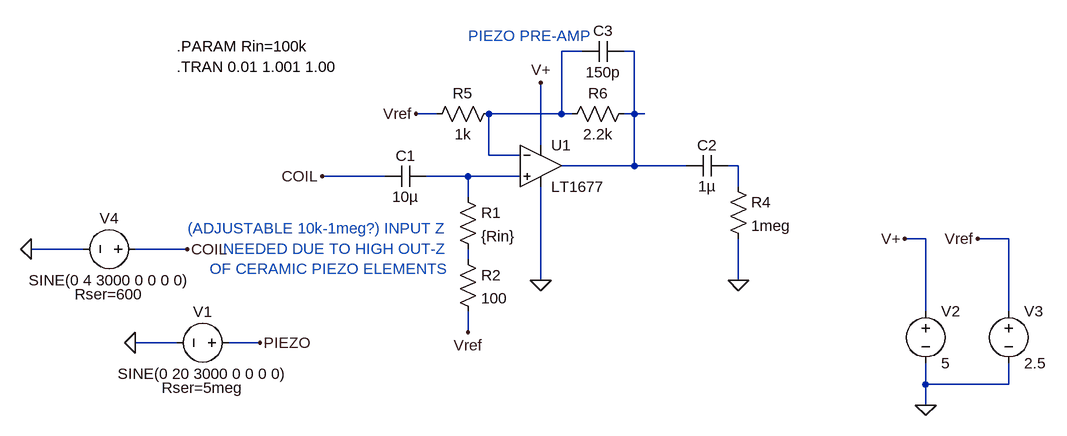
[diagram p0: schematic piezo_input_stage.asc]
piezo_input_stage.asc, the LTspice schematic file:
Version 4
SHEET 1 1100 680
WIRE 208 64 176 64
WIRE 288 64 272 64
WIRE -16 160 -48 160
WIRE 176 160 176 64
WIRE 176 160 64 160
WIRE 192 160 176 160
WIRE 288 160 288 64
WIRE 288 160 272 160
WIRE 304 160 288 160
WIRE 144 208 144 112
WIRE 64 224 64 160
WIRE 112 224 64 224
WIRE 288 240 288 160
WIRE 288 240 176 240
WIRE 368 240 288 240
WIRE 448 240 432 240
WIRE -96 256 -192 256
WIRE 32 256 -32 256
WIRE 112 256 32 256
WIRE 448 272 448 240
WIRE 32 288 32 256
WIRE 736 352 704 352
WIRE 864 352 816 352
WIRE -560 368 -640 368
WIRE -400 368 -480 368
WIRE 32 384 32 368
WIRE 144 416 144 272
WIRE 448 416 448 352
WIRE 736 464 736 352
WIRE 864 464 864 352
WIRE 32 496 32 464
WIRE -416 512 -480 512
WIRE -288 512 -336 512
WIRE 736 576 736 544
WIRE 864 576 864 544
WIRE 864 576 736 576
WIRE 736 608 736 576
FLAG 32 496 Vref
FLAG 144 416 0
FLAG 144 112 V+
FLAG -192 256 COIL
FLAG -480 512 0
FLAG -288 512 PIEZO
FLAG 704 352 V+
FLAG 816 352 Vref
FLAG 448 416 0
FLAG 736 608 0
FLAG -48 160 Vref
FLAG -640 368 0
FLAG -400 368 COIL
SYMBOL Opamps/LT1677 144 176 R0
SYMATTR InstName U1
SYMBOL cap -32 240 R90
WINDOW 0 0 32 VBottom 2
WINDOW 3 32 32 VTop 2
SYMATTR InstName C1
SYMATTR Value 10µ
SYMBOL res 16 272 R0
SYMATTR InstName R1
SYMATTR Value {Rin}
SYMBOL voltage -320 512 R90
WINDOW 0 -32 56 VBottom 2
WINDOW 3 32 56 VTop 2
WINDOW 39 54 56 VTop 2
SYMATTR InstName V1
SYMATTR Value SINE(0 20 3000 0 0 0 0)
SYMATTR SpiceLine Rser=5meg
SYMATTR Value2 AC 10
SYMBOL voltage 736 448 R0
SYMATTR InstName V2
SYMATTR Value 5
SYMBOL res 432 256 R0
SYMATTR InstName R4
SYMATTR Value 1meg
SYMBOL res 80 144 R90
WINDOW 0 0 56 VBottom 2
WINDOW 3 32 56 VTop 2
SYMATTR InstName R5
SYMATTR Value 1k
SYMBOL res 288 144 R90
WINDOW 0 0 56 VBottom 2
WINDOW 3 32 56 VTop 2
SYMATTR InstName R6
SYMATTR Value 2.2k
SYMBOL voltage 864 448 R0
SYMATTR InstName V3
SYMATTR Value 2.5
SYMBOL cap 432 224 R90
WINDOW 0 0 32 VBottom 2
WINDOW 3 32 32 VTop 2
SYMATTR InstName C2
SYMATTR Value 1µ
SYMBOL cap 272 48 R90
WINDOW 0 0 32 VBottom 2
WINDOW 3 32 32 VTop 2
SYMATTR InstName C3
SYMATTR Value 150p
SYMBOL voltage -464 368 R90
WINDOW 0 -32 56 VBottom 2
WINDOW 3 32 56 VTop 2
WINDOW 39 54 56 VTop 2
SYMATTR InstName V4
SYMATTR Value SINE(0 4 3000 0 0 0 0)
SYMATTR SpiceLine Rser=600
SYMATTR Value2 AC 10
SYMBOL res 16 368 R0
SYMATTR InstName R2
SYMATTR Value 100
TEXT 32 40 Left 2 ;PIEZO PRE-AMP
TEXT 0 336 Right 2 ;(ADJUSTABLE 10k-1meg?) INPUT Z\nNEEDED DUE TO HIGH OUT-Z\nOF CERAMIC PIEZO ELEMENTS
TEXT -416 56 Left 2 !.PARAM Rin=100k\n.TRAN 0.01 1.001 1.00

The netlist it stands for:
* piezo_input_stage.asc
XU1 N004 N001 V+ 0 N002 LT1677  ; pins In+ In- V+ V- OUT
C1 N004 COIL 10µ
R1 N004 N005 {Rin}
V1 PIEZO 0 SINE(0 20 3000 0 0 0 0) AC 10 Rser=5meg
V2 V+ 0 5
R4 N003 0 1meg
R5 N001 Vref 1k
R6 N002 N001 2.2k
V3 Vref 0 2.5
C2 N003 N002 1µ
C3 N002 N001 150p
V4 COIL 0 SINE(0 4 3000 0 0 0 0) AC 10 Rser=600
R2 N005 Vref 100
* PIEZO PRE-AMP
* (ADJUSTABLE 10k-1meg?) INPUT Z
* NEEDED DUE TO HIGH OUT-Z
* OF CERAMIC PIEZO ELEMENTS
.PARAM Rin=100k
.TRAN 0.01 1.001 1.00
.lib LTC.lib
.backanno
.end